# Altium schematic sheet LOOP_DAC.SchDoc: {Наименование}
size 420 x 297 mm; ApprovedBy: {Утвердил}; CheckedBy: {Проверил}; DrawnBy: {Разраб.}; SheetNumber: 2; Scale: {Мш.}; PageSetup: Record=PageOptions|CenterHorizontal=False|CenterVertical=False|PrintScale=0.95|XCorrection=0.00|YCorrection=0.00|PrintKind=1|BorderSize=5000000|LeftOffset=0|BottomOffset=0|Orientation=1|PaperLength=1000|PaperWidth=1000|Scale=100|PaperSource=15|PrintQuality=600|MediaType=1|DitherType=10|PaperKind=A4|PrintScaleMode=1; ProcessInspection: {Т.контр.}; Mass: {М.}; NormInspection: {Н.контр.}; Letter1Column: {}; Letter2Column: {}; Letter3Column: {}; DocumentType: {Документ}; Rule: PcbType=ProtelPcb
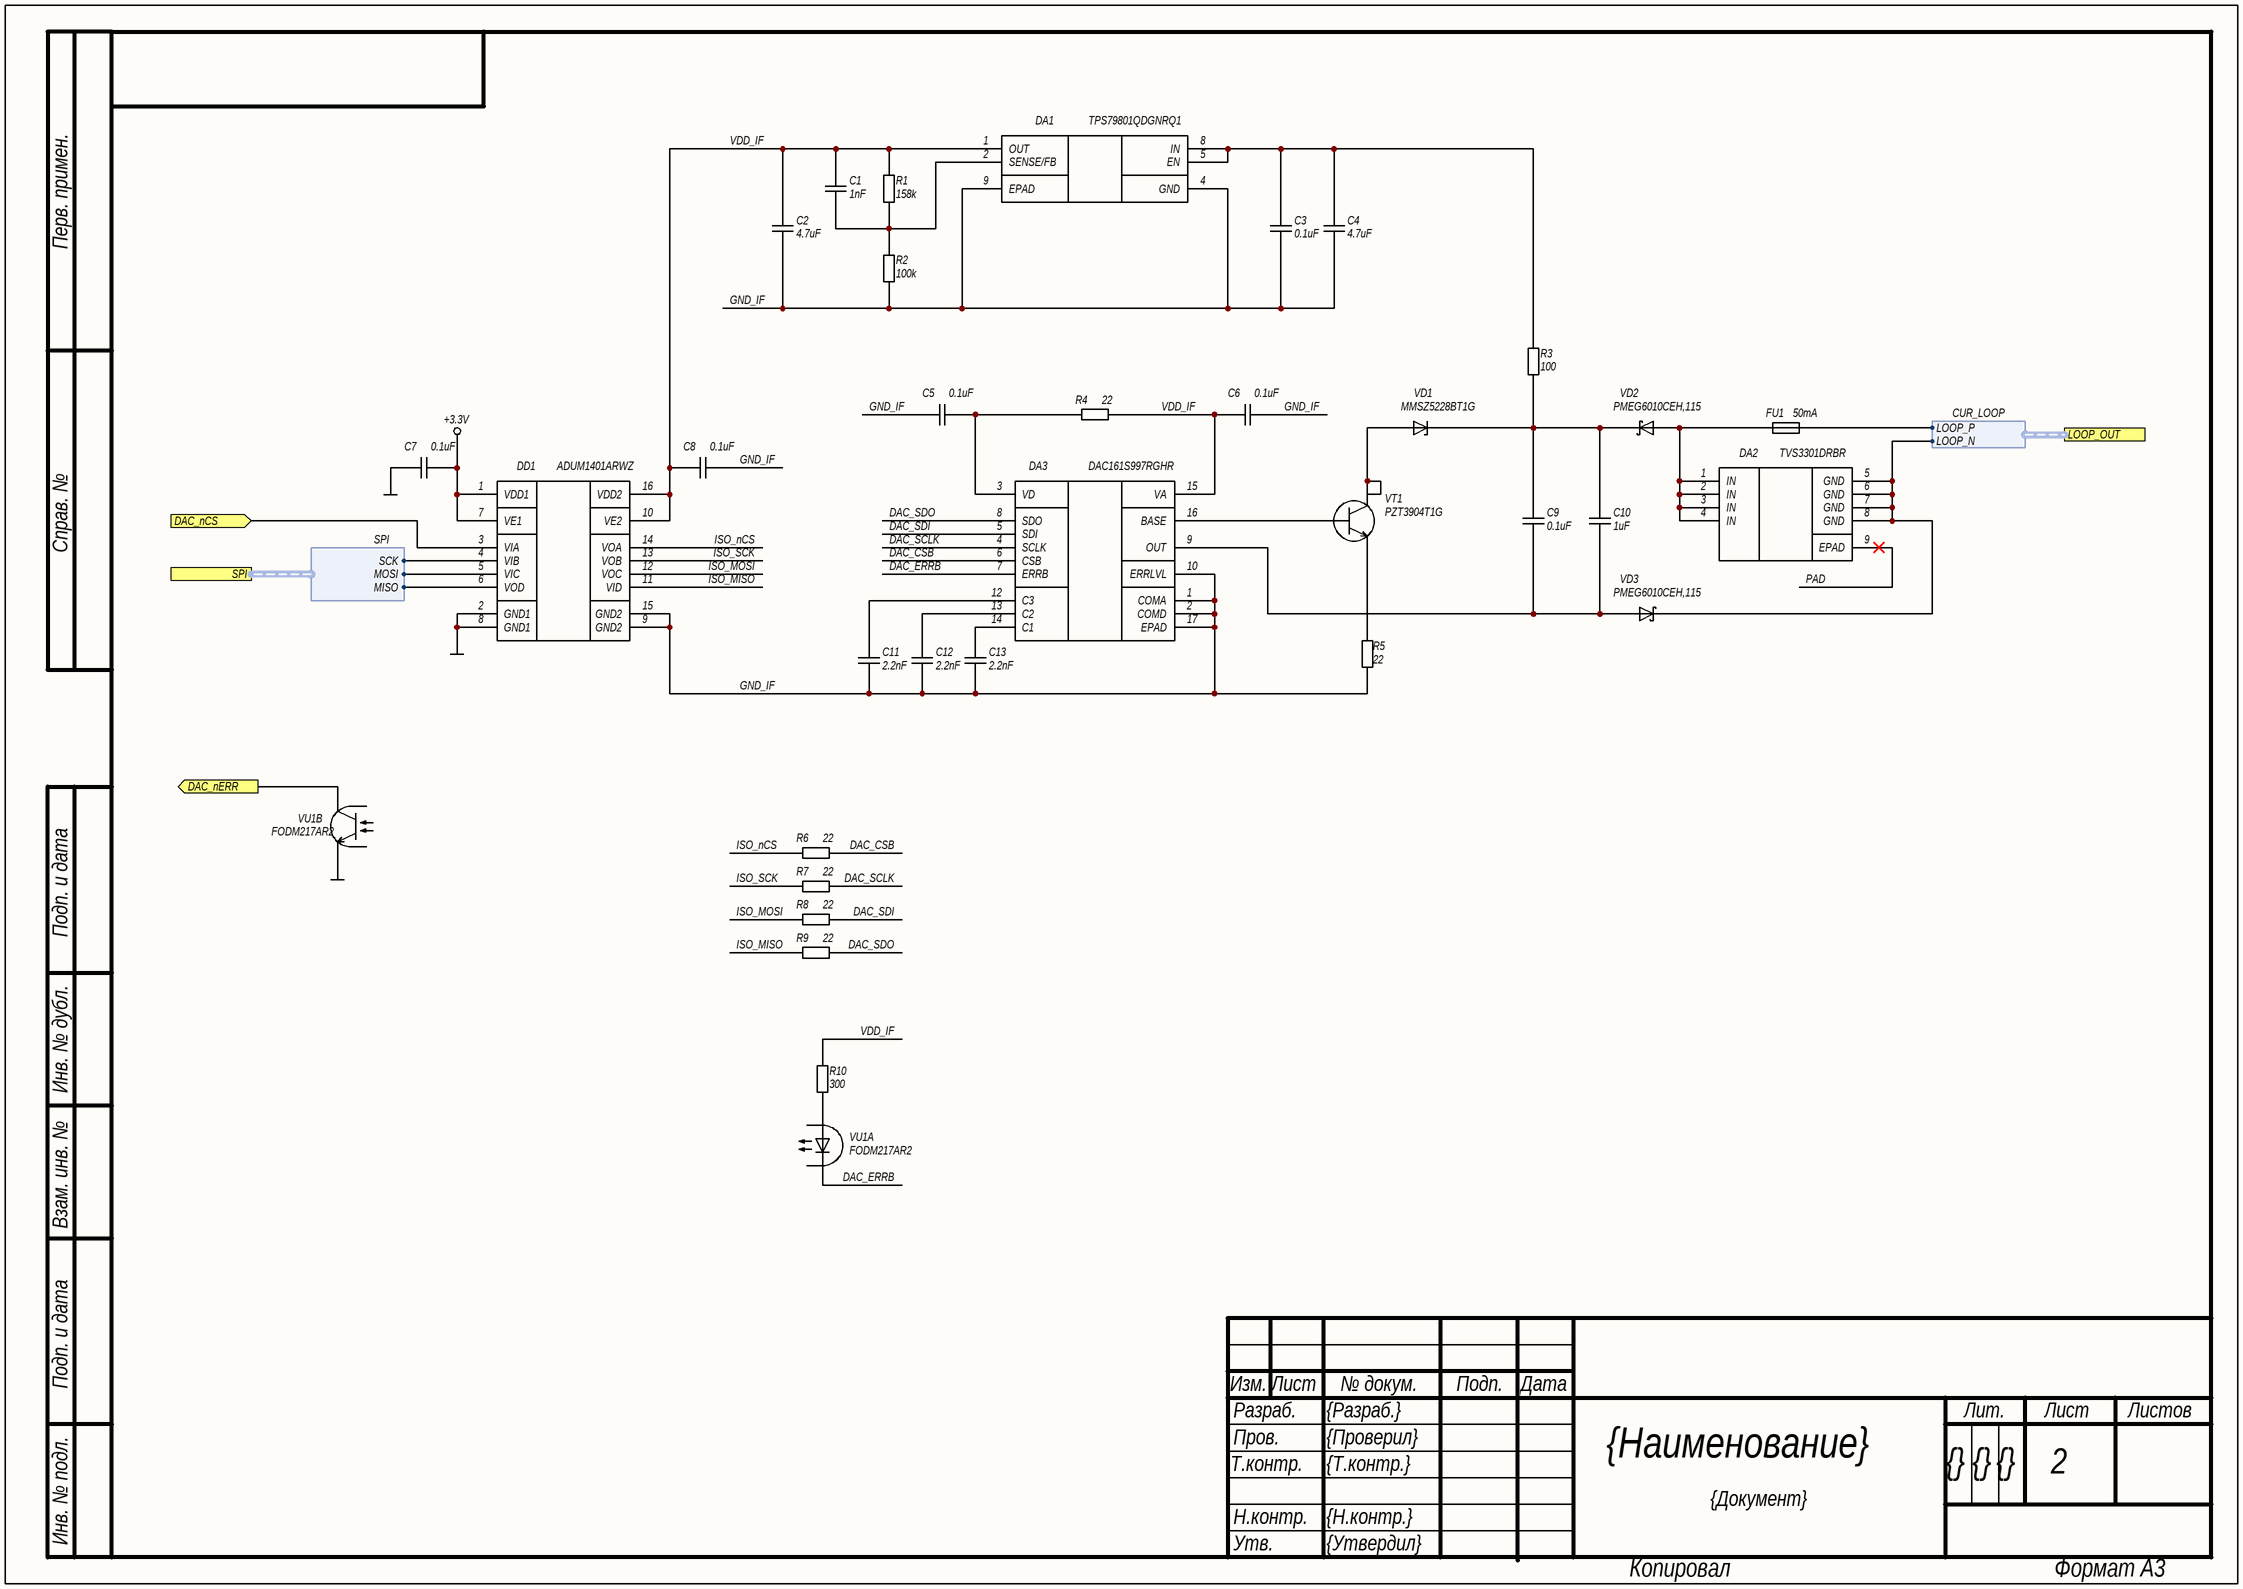
[diagram p0: LOOP_DAC.SchDoc]

## Parts
C1  1nF  [C0603N]
C2  4.7uF  [C0805N]
C3  0.1uF  [C0603N]
C4  4.7uF  [C1206N]
C5  0.1uF  [C0603N]
C6  0.1uF  [C0603N]
C7  0.1uF  [C0603N]
C8  0.1uF  [C0603N]
C9  0.1uF  [C0603N]
C10  1uF  [C0603N]
C11  2.2nF  [C0603N]
C12  2.2nF  [C0603N]
C13  2.2nF  [C0603N]
DA1  TPS79801QDGNRQ1  [DGN0008B]
DA2  TVS3301DRBR  [DRB0008A]
DA3  DAC161S997RGHR  [RGH0016A]
DD1  ADUM1401ARWZ  [SOIC16_W]
FU1  50mA  [0ZCJ_0.85]
R1  158k  [R0603N]
R2  100k  [R0603N]
R3  100  [R0603N]
R4  22  [R0603N]
R5  22  [R0603N]
R6  22  [R0603N]
R7  22  [R0603N]
R8  22  [R0603N]
R9  22  [R0603N]
R10  300  [R0603N]
VD1  MMSZ5228BT1G  [SOD123]
VD2  PMEG6010CEH,115  [SOD123F]
VD3  PMEG6010CEH,115  [SOD123F]
VT1  PZT3904T1G  [SOT223]
VU1  FODM217AR2  [MFP4 2.5x4.4]  (parts A,B of 2)

## Ports
DAC_nCS (in), DAC_nERR (out), LOOP_OUT (harness CUR_LOOP), SPI (harness SPI)

## Harnesses
SPI: MISO, MOSI, SCK
CUR_LOOP: LOOP_P, LOOP_N

## Nets
+3.3V: C7.1 DD1.1(VDD1) DD1.7(VE1)
GND: C7.2 DD1.2(GND1) DD1.8(GND1) VU1.3(E)
DAC_CSB: DA3.6(CSB) R6.1
DAC_ERRB: DA3.7(ERRB) VU1.2(K)
DAC_nCS: DD1.3(VIA) ; port DAC_nCS
DAC_nERR: VU1.4(C) ; port DAC_nERR
DAC_SCLK: DA3.4(SCLK) R7.1
DAC_SDI: DA3.5(SDI) R8.1
DAC_SDO: DA3.8(SDO) R9.1
GND_IF: C2.2 C3.1 C4.2 C5.2 C6.1 C8.1 C11.1 C12.1 C13.1 DA1.4(GND) DA1.9(EPAD) DA3.1(COMA) DA3.2(COMD) DA3.10(ERRLVL) DA3.17(EPAD) DD1.9(GND2) DD1.15(GND2) R2.2 R5.2
ISO_MISO: DD1.11(VID) R9.2
ISO_MOSI: DD1.12(VOC) R8.2
ISO_nCS: DD1.14(VOA) R6.2
ISO_SCK: DD1.13(VOB) R7.2
PAD: DA2.9(EPAD)
VDD_IF: C1.1 C2.1 C6.2 C8.2 DA1.1(OUT) DA3.15(VA) DD1.10(VE2) DD1.16(VDD2) R1.1 R4.1 R10.1
NetC1_2: C1.2 DA1.2(SENSE/FB) R1.2 R2.1
NetC3_2: C3.2 C4.1 DA1.5(EN) DA1.8(IN) R3.1
NetC5_1: C5.1 DA3.3(VD) R4.2
NetC9_1: C9.1 C10.1 R3.2 VD1.1(K) VD2.1(K)
NetC9_2: C9.2 C10.2 DA3.9(OUT) VD3.2(A)
NetC11_2: C11.2 DA3.12(C3)
NetC12_2: C12.2 DA3.13(C2)
NetC13_2: C13.2 DA3.14(C1)
NetDA2_1: DA2.1(IN) DA2.2(IN) DA2.3(IN) DA2.4(IN) FU1.2 VD2.2(A)
NetDA2_5: DA2.5(GND) DA2.6(GND) DA2.7(GND) DA2.8(GND) VD3.1(K) ; port LOOP_OUT.LOOP_N
NetDA3_16: DA3.16(BASE) VT1.1(B)
NetDD1_4: DD1.4(VIB) ; port SPI.SCK
NetDD1_5: DD1.5(VIC) ; port SPI.MOSI
NetDD1_6: DD1.6(VOD) ; port SPI.MISO
NetFU1_1: FU1.1 ; port LOOP_OUT.LOOP_P
NetR5_1: R5.1 VT1.3(E)
NetR10_2: R10.2 VU1.1(A)
NetVD1_2: VD1.2(A) VT1.2(C) VT1.4(C)

## Notes on the sheet
- Перв. примен.
- Справ. №
- Подп. и дата
- Инв. № дубл.
- Взам. инв. №
- Изм.
- Лист
- № докум.
- Подп.
- Дата
- Т.контр.
- Пров.
- Разраб.
- Лит.
- Листов
- Инв. № подл.
- Н.контр.
- Утв.
- Копировал
- Формат А3

## Library data of the parts
C1 = CL10B102KC8NNNC: Конденсатор; Точность: 10%; Напряжение: 100V; Диэлектрик: X7R; Производитель: Samsung Electro-Mechanics; Описание: 1000 pF ±10% 100V Ceramic Capacitor X7R 0603 (1608 Metric); Корпус: 0603 (1608 Metric); Температурный диапазон: -55°C ~ 125°C; Вид монтажа: SMD; Артикул: CL10B102KC8NNNC; Номинал: 1nF; Строка для документации: https://mm.digikey.com/Volume0/opasdata/d220001/medias/docus/1136/CL10B102KC8NNNC_Spec.pdf; Тип элемента: Конденсатор
C2 = CL21A475KAQNNNG: Конденсатор; Точность: 10%; Напряжение: 25V; Диэлектрик: X5R; Производитель: Samsung Electro-Mechanics; Описание: 4.7 µF ±10% 25V Ceramic Capacitor X5R 0805 (2012 Metric); Корпус: 0805 (2012 Metric); Температурный диапазон: -55°C ~ 85°C; Вид монтажа: SMD; Артикул: CL21A475KAQNNNG; Номинал: 4.7uF; Строка для документации: https://mm.digikey.com/Volume0/opasdata/d220001/medias/docus/41/CL21A475KAQNNNG_DS.pdf; Тип элемента: Конденсатор
C3 C5-C9 = CL10B104KB8NNNC: Конденсатор; Точность: 10%; Напряжение: 50V; Диэлектрик: X7R; Производитель: Samsung Electro-Mechanics; Описание: 0.1 µF ±10% 50V Ceramic Capacitor X7R 0603 (1608 Metric); Корпус: 0603 (1608 Metric); Температурный диапазон: -55°C ~ 125°C; Вид монтажа: SMD; Артикул: CL10B104KB8NNNC; Номинал: 0.1uF; Строка для документации: https://mm.digikey.com/Volume0/opasdata/d220001/medias/docus/609/CL10B104KB8NNNC_Spec.pdf; Тип элемента: Конденсатор
C4 = CC1206KKX7R9BB475: Конденсатор; Точность: 10%; Напряжение: 50V; Диэлектрик: X7R; Производитель: YAGEO; Описание: 4.7 µF ±10% 50V Ceramic Capacitor X7R 1206 (3216 Metric); Корпус: 1206 (3216 Metric); Строка для документации: ttps://www.yageo.com/upload/media/product/productsearch/datasheet/mlcc/UPY-NP0X7R_HV_1KV-to-3KV_13.pdf; Температурный диапазон: -55°C ~ 125°C; Вид монтажа: SMD; Артикул: CC1206KKX7R9BB475; Номинал: 4.7uF; Тип элемента: Конденсатор
C10 = CC0603KRX7R9BB105: Конденсатор; Точность: 10%; Напряжение: 50V; Диэлектрик: X7R; Производитель: YAGEO; Описание: 1 µF ±10% 50V Ceramic Capacitor X7R 0603 (1608 Metric); Корпус: 0603 (1608 Metric); Температурный диапазон: -55°C ~ 125°C; Вид монтажа: SMD; Артикул: CC0603KRX7R9BB105; Номинал: 1uF; Строка для документации: https://www.yageo.com/upload/media/product/productsearch/datasheet/mlcc/UPY-GPHC_X7R_6.3V-to-250V_24.pdf; Тип элемента: Конденсатор
C11-C13 = CC0603JRNPO9BN222: Конденсатор; Точность: 5%; Напряжение: 50V; Диэлектрик: NP0; Производитель: YAGEO; Описание: 2200 pF ±5% 50V Ceramic Capacitor C0G, NP0 0603 (1608 Metric); Корпус: 0603 (1608 Metric); Температурный диапазон: -55°C ~ 125°C; Вид монтажа: SMD; Артикул: CC0603JRNPO9BN222; Номинал: 2.2nF; Строка для документации: https://www.yageo.com/upload/media/product/productsearch/datasheet/mlcc/UPY-GPHC_X7R_6.3V-to-250V_24.pdf; Тип элемента: Конденсатор
DA1 = TPS79801QDGNRQ1: Микросхема линейный стабилизатор напряжения; Производитель: Texas Instruments; Описание: Linear Voltage Regulator IC Positive Adjustable 1 Output 50mA 8-HVSSOP; Корпус: 8-HVSSOP; Температурный диапазон: -40°C ~ 125°C; Вид монтажа: SMD; Артикул: TPS79801QDGNRQ1; Строка для документации: https://www.ti.com/lit/ds/symlink/tps798-q1.pdf; Тип элемента: Микросхема
DA2 = TVS3301DRBR: Микросхема ограничитель выбросов напряжения; Напряжение: 33V; Напряжение ограничения: 42.5V; Напряжение пробоя: 37.5V; Ток: 27A; Тип: TVS Unidirectional; Производитель: Texas Instruments; Описание: Mixed Technology TVS Device Circuit 42.5V Surface Mount 8-SON (3x3); Корпус: 8-SON (3x3); Температурный диапазон: -40°C ~ 125°C (TA); Вид монтажа: SMD; Тип элемента: Диод защитный; Артикул: TVS3301DRBR; Строка для документации: https://www.ti.com/lit/ds/symlink/tvs3301.pdf
DA3 = DAC161S997RGHR: Микросхема 16-бит ЦАП с токовым выходом 4-20mA; Производитель: Texas Instruments; Описание: 16-Bit SPI-Programmable DAC for 4-20 mA Loops 16-WQFN (4x4); Корпус: 16-WFQFN Exposed Pad; Температурный диапазон: -40°C ~ 105°C; Вид монтажа: SMD; Артикул: DAC161S997RGHR; Строка для документации: https://www.ti.com/lit/ds/symlink/dac161s997.pdf; Тип элемента: Микросхема
DD1 = ADUM1401ARWZ: Микросхема цифровой изолятор интерфейса; Производитель: Analog Devices Inc.; Описание: General Purpose Digital Isolator 2500Vrms 4 Channel 1Mbps 25kV/µs CMTI 16-SOIC (0.295", 7.50mm Width); Корпус: 16-SOIC (0.295", 7.50mm Width); Температурный диапазон: -40°C ~ 105°C; Вид монтажа: SMD; Артикул: ADUM1401ARWZ; Строка для документации: https://www.analog.com/media/en/technical-documentation/data-sheets/ADuM1400_1401_1402.pdf; Тип элемента: Микросхема
FU1 = 0ZCJ0005FF2E: Плавкий предохранитель; Напряжение: 60V; Тип: PTC Resettable Fuse; Производитель: Bel Fuse Inc.; Описание: Polymeric PTC Resettable Fuse 60V 50 mA Ih Surface Mount 1206 (3216 Metric), Concave; Корпус: 1206 (3216 Metric), Concave; Температурный диапазон: -40°C ~ 85°C; Вид монтажа: SMD; Артикул: 0ZCJ0005FF2E; Ток: 50mA; Строка для документации: https://www.belfuse.com/resources/datasheets/circuitprotection/ds-cp-0zcj-series.pdf; Тип элемента: Предохранитель
R1 = RC0603FR-07158KL: Резистор; Точность: 1%; ТКС: ±100ppm/°C; Напряжение: 75V; Производитель: YAGEO; Описание: 158 kOhms ±1% 0.1W, 1/10W Chip Resistor 0603 (1608 Metric) Moisture Resistant Thick Film; Корпус: 0603 (1608 Metric); Температурный диапазон: -55°C ~ 155°C; Вид монтажа: SMD; Артикул: RC0603FR-07158KL; Номинал: 158k; Строка для документации: https://www.yageo.com/upload/media/product/app/datasheet/rchip/pyu-rc_group_51_rohs_l.pdf; Тип элемента: Резистор
R2 = RC0603FR-07100KL: Резистор; Точность: 1%; ТКС: ±100ppm/°C; Напряжение: 75V; Производитель: YAGEO; Описание: 100 kOhms ±1% 0.1W, 1/10W Chip Resistor 0603 (1608 Metric) Moisture Resistant Thick Film; Корпус: 0603 (1608 Metric); Температурный диапазон: -55°C ~ 155°C; Вид монтажа: SMD; Артикул: RC0603FR-07100KL; Номинал: 100k; Строка для документации: https://www.yageo.com/upload/media/product/app/datasheet/rchip/pyu-rc_group_51_rohs_l.pdf; Тип элемента: Резистор
R3 = RC0603FR-07100RL: Резистор; Точность: 1%; ТКС: ±100ppm/°C; Напряжение: 75V; Производитель: YAGEO; Описание: 100 Ohms ±1% 0.1W, 1/10W Chip Resistor 0603 (1608 Metric) Moisture Resistant Thick Film; Корпус: 0603 (1608 Metric); Температурный диапазон: -55°C ~ 155°C; Вид монтажа: SMD; Артикул: RC0603FR-07100RL; Номинал: 100; Строка для документации: https://www.yageo.com/upload/media/product/app/datasheet/rchip/pyu-rc_group_51_rohs_l.pdf; Тип элемента: Резистор
R4-R9 = RC0603FR-0722RL: Резистор; Точность: 1%; ТКС: ±100ppm/°C; Напряжение: 75V; Производитель: YAGEO; Описание: 22 Ohms ±1% 0.1W, 1/10W Chip Resistor 0603 (1608 Metric) Moisture Resistant Thick Film; Корпус: 0603 (1608 Metric); Температурный диапазон: -55°C ~ 155°C; Вид монтажа: SMD; Артикул: RC0603FR-0722RL; Номинал: 22; Строка для документации: https://www.yageo.com/upload/media/product/app/datasheet/rchip/pyu-rc_group_51_rohs_l.pdf; Тип элемента: Резистор
R10 = RC0603FR-07300RL: Резистор; Точность: 1%; ТКС: ±100ppm/°C; Напряжение: 75V; Производитель: YAGEO; Описание: 300 Ohms ±1% 0.1W, 1/10W Chip Resistor 0603 (1608 Metric) Moisture Resistant Thick Film; Корпус: 0603 (1608 Metric); Температурный диапазон: -55°C ~ 155°C; Вид монтажа: SMD; Артикул: RC0603FR-07300RL; Номинал: 300; Строка для документации: https://www.yageo.com/upload/media/product/app/datasheet/rchip/pyu-rc_group_51_rohs_l.pdf; Тип элемента: Резистор
VD1 = MMSZ5228BT1G: Стабилитрон; Прямой ток: 20mA; Напряжение: 3.9V; Производитель: onsemi; Описание: Zener Diode 3.9 V 500 mW ±5% Surface Mount SOD-123; Корпус: SOD-123; Температурный диапазон: -55°C ~ 150°C; Вид монтажа: SMD; Тип элемента: Диод; Артикул: MMSZ5228BT1G; Тип: Zener; Строка для документации: https://www.onsemi.com/pdf/datasheet/mmsz5221bt1-d.pdf
VD2 VD3 = PMEG6010CEH,115: Диод Шоттки; Прямой ток: 1A; Напряжение: 60V; Производитель: Nexperia USA Inc.; Описание: Diode 60 V 1A Surface Mount SOD-123F; Корпус: SOD-123F; Температурный диапазон: -65°C ~ 150°C; Вид монтажа: SMD; Артикул: PMEG6010CEH,115; Тип: Schottky; Строка для документации: https://assets.nexperia.com/documents/data-sheet/PMEG6010CEH.pdf; Тип элемента: Диод
VT1 = PZT3904T1G: Биполярный транзистор, NPN структуры; Ток: 0.2A; Напряжение: 40V; Производитель: onsemi; Описание: Bipolar (BJT) Transistor NPN 40 V 200 mA 300MHz 1.5 W Surface Mount SOT-223 (TO-261); Корпус: SOT-223 (TO-261); Температурный диапазон: -55°C ~ 150°C (TJ); Вид монтажа: SMD; Тип элемента: Транзистор биполярный; Артикул: PZT3904T1G; Тип: NPN
VU1 = FODM217AR2: NPN транзисторная оптопара; Прямой ток: 50mA; Напряжение: 1.2V; Производитель: onsemi; Описание: Optoisolator Transistor Output 3750Vrms 1 Channel 4-SOP; Корпус: 4-SOIC (0.173", 4.40mm Width); Температурный диапазон: -55°C ~ 110°C; Вид монтажа: SMD; Артикул: FODM217AR2; Строка для документации: https://www.onsemi.com/pdf/datasheet/fodm214-d.pdf; Тип элемента: Транзисторная оптопара